# EAGLE schematic sensor_distancia (EAGLE 9.6.2)
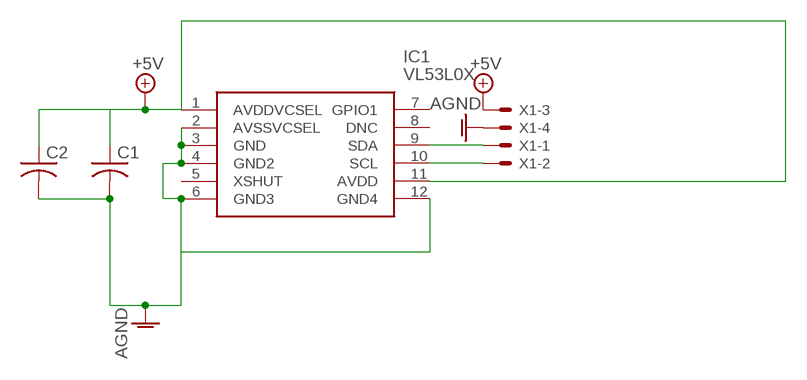
[diagram p0: schematic, sheet 1]

## Parts
C1  C-US025-025X050  [C025-025X050]
C2  C-US025-025X050  [C025-025X050]
IC1  VL53L0X  [VL53L0X]
X1  KK-156-4  [KK-156-4]

## Nets
+5V: C1.1 C2.1 IC1.1(AVDDVCSEL) IC1.11(AVDD) X1.3
AGND: C1.2 C2.2 IC1.2(AVSSVCSEL) IC1.3(GND) IC1.4(GND2) IC1.6(GND3) IC1.12(GND4) X1.4
N$1: IC1.10(SCL) X1.2
N$2: IC1.9(SDA) X1.1
Unconnected: IC1.5(XSHUT) IC1.7(GPIO1) IC1.8(DNC)

## Library data of the parts
C1 C2 = rcl:C-US: CAPACITOR, American symbol; SPICEPREFIX: C
IC1 = VL53L0X:VL53L0X: World smallest Time-of-Flight ranging and gesture detection sensor Source: Datasheet <https://www.mouser.com/ds/2/389/vl53l0x-1156212.pdf>; DESCRIPTION: World smallest Time-of-Flight ranging and gesture detection sensor; HEIGHT: 1mm; MANUFACTURER_NAME: STMicroelectronics; MANUFACTURER_PART_NUMBER: VL53L0X
X1 = con-molex:KK-156-4: KK 156 HEADER Source: http://www.molex.com/pdm_docs/sd/026604100_sd.pdf; MF: MOLEX; OC_FARNELL: unknown; OC_NEWARK: unknown